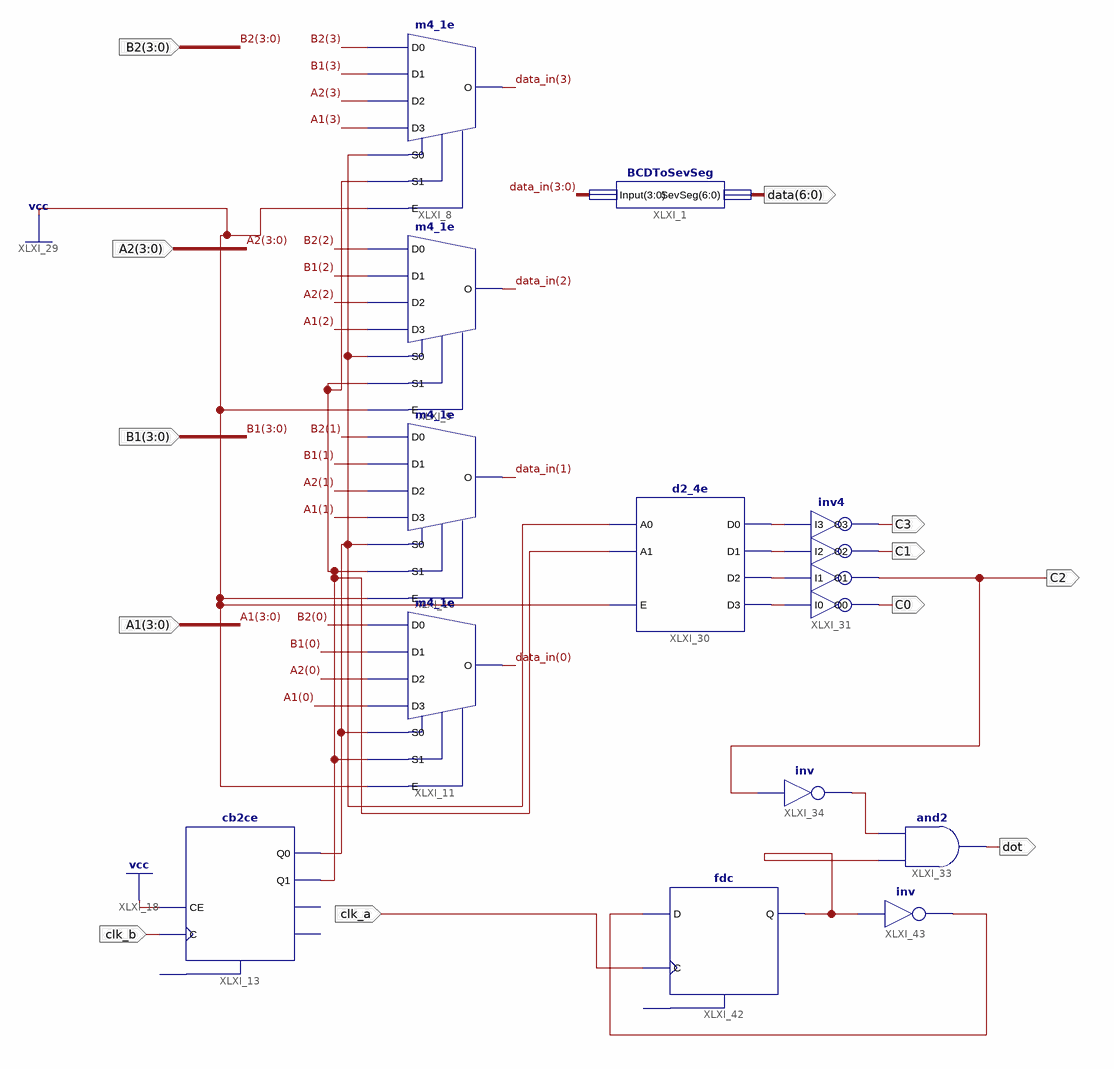
[diagram p0: schematic sheet 1]
// Xilinx ISE schematic display.sch (spartan6) as structural Verilog: 12 symbols, 12 ports
module display (
  input  [3:0] B2,
  input  [3:0] A2,
  input  [3:0] B1,
  input  [3:0] A1,
  input  clk_b,
  input  clk_a,
  output [6:0] data,
  output C0,
  output C2,
  output C3,
  output C1,
  output dot
);

  wire XLXN_93, XLXN_94, XLXN_95, XLXN_96, XLXN_99, XLXN_107, XLXN_117, XLXN_118, XLXN_120;
  wire [3:0] data_in;

  BCDToSevSeg XLXI_1 (.Input(data_in), .SevSeg(data));
  m4_1e XLXI_8 (.D0(B2[3]), .D1(B1[3]), .D2(A2[3]), .D3(A1[3]), .E(1'b1), .S0(XLXN_118), .S1(XLXN_117), .O(data_in[3]));
  m4_1e XLXI_9 (.D0(B2[2]), .D1(B1[2]), .D2(A2[2]), .D3(A1[2]), .E(1'b1), .S0(XLXN_118), .S1(XLXN_117), .O(data_in[2]));
  m4_1e XLXI_10 (
    .D0(B2[1]), .D1(B1[1]), .D2(A2[1]), .D3(A1[1]), .E(1'b1), .S0(XLXN_118), .S1(XLXN_117), .O(data_in[1]));
  m4_1e XLXI_11 (
    .D0(B2[0]), .D1(B1[0]), .D2(A2[0]), .D3(A1[0]), .E(1'b1), .S0(XLXN_118), .S1(XLXN_117), .O(data_in[0]));
  cb2ce XLXI_13 (.C(clk_b), .CE(1'b1), .Q0(XLXN_118), .Q1(XLXN_117));  // open: CLR, CEO, TC
  d2_4e XLXI_30 (.A0(XLXN_118), .A1(XLXN_117), .E(1'b1), .D0(XLXN_93), .D1(XLXN_94), .D2(XLXN_95), .D3(XLXN_96));
  inv4 XLXI_31 (.I0(XLXN_96), .I1(XLXN_95), .I2(XLXN_94), .I3(XLXN_93), .O0(C0), .O1(C2), .O2(C1), .O3(C3));
  and XLXI_33 (dot, XLXN_99, XLXN_107);
  not XLXI_34 (XLXN_107, C2);
  fdc XLXI_42 (.C(clk_a), .D(XLXN_120), .Q(XLXN_99));  // open: CLR
  not XLXI_43 (XLXN_120, XLXN_99);
endmodule
